# EAGLE design porta OU M (EAGLE 6.1)
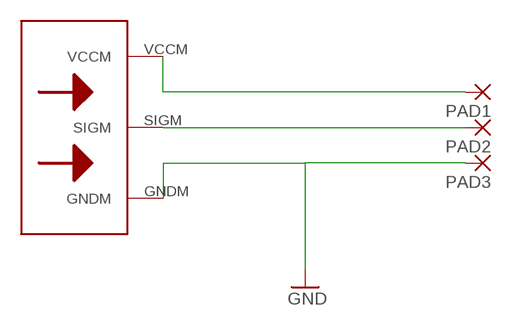
[diagram p0: schematic, sheet 1]

## Parts
PAD1  SMD5  [SMD2,54-5,08]
PAD2  SMD5  [SMD2,54-5,08]
PAD3  SMD5  [SMD2,54-5,08]
U$1  BITWIREM  [BITWIREM]

## Nets
GND: PAD3.1(P) U$1.GNDM
N$3: PAD1.1(P) U$1.VCCM
SIG2: PAD2.1(P) U$1.SIGM

## Library data of the parts
PAD1-PAD3 = wirepad:SMD5: SMD PAD
U$1 = bigbits:BITWIREM: BitWire Male Entrada de Sínal <<---

## Board
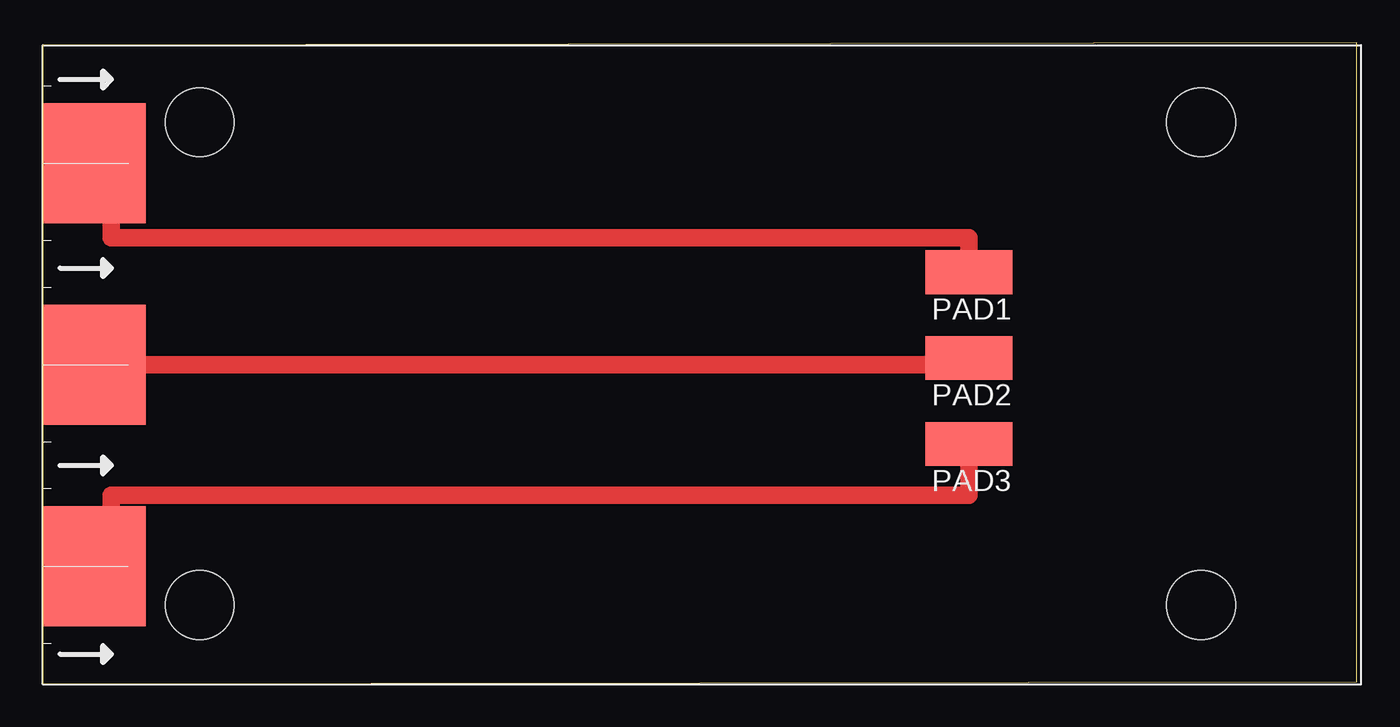
[diagram p1: board, top side]

Size 76.62 x 37.38 mm. Coordinates in mm from the lower left corner, seen from the top.
Outline: 0,0 76.62,0.12 76.62,37.38 0,37.25 0,0
Copper layers (1*16): Top 0.035mm / dielectric 1.5mm / Bottom 0.035mm
Design rules: minimum track width 10mil, minimum drill 24mil, track to track 8mil, track to pad 8mil, pad to pad 8mil, via to via 8mil, smd to smd 8mil, copper to edge 40mil, drill to drill 8mil, minimum pad ring 10mil, minimum via ring 8mil, stop-mask expansion 4mil, vias tented up to drill 0mil, thermal gap 10mil

### Footprints (pad centres in the part's own frame; a part is rotated, then mirrored left to right if it is on the bottom)
SMD2,54-5,08 = smd 2.54 x 5.08: 1 0,0
BITWIREM = smd 6 x 7: GNDM 3,-30.39; SIGM 3,-18.65; VCCM 3,-6.9 | hole 4: 9.15,-4.5; 9.15,-32.64; 67.55,-4.5; 67.55,-32.64

### Placement (x,y rotation side)
PAD1  54,24 90 top
PAD2  54,19 90 top
PAD3  54,14 90 top
U$1  0,37.25 0 top

### Tracks (layer width: path | path; a pad name or v marks a point on that pad's centre or on a via)
GND
  Top 1.016: U$1.GNDM 4,6.86 4,11 54,11 PAD3.1
N$3
  Top 0.406: U$1.VCCM 4,30.35
  Top 1.016: 4,30.35 4,26 54,26 PAD1.1
SIG2
  Top 1.016: U$1.SIGM 54,18.6 PAD2.1